# Altium schematic sheet KeyPadScanner.SchDoc
size B; PART_NAME: xc2s200epq208-5; Organization: Altium Limited; Address1: L3, 12a Rodborough Rd; Address2: Frenchs Forest; Address3: NSW; Address4: Australia 2086; DocumentNumber: 1; SheetNumber: 1; SheetTotal: 1
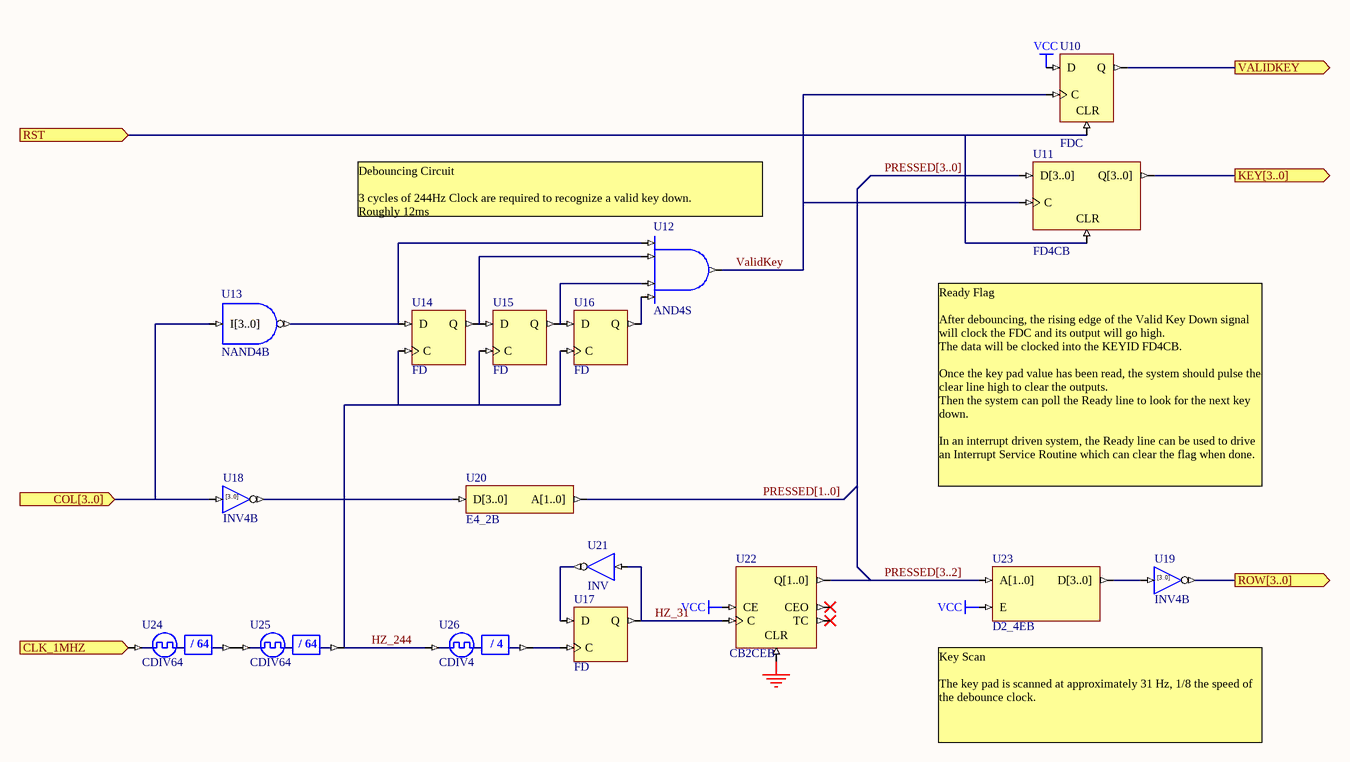
[diagram p0: KeyPadScanner.SchDoc]

## Parts
U10  FDC
U11  FD4CB
U12  AND4S
U13  NAND4B
U14  FD
U15  FD
U16  FD
U17  FD
U18  INV4B
U19  INV4B
U20  E4_2B
U21  INV
U22  CB2CEB
U23  D2_4EB
U24  CDIV64
U25  CDIV64
U26  CDIV4

## Ports
CLK_1MHZ (in), COL[3..0] (in), KEY[3..0] (out), ROW[3..0] (out), RST (in), VALIDKEY (out)

## Nets
GND: U22.CLR
VCC: U10.D U22.CE U23.E
CLK_1MHZ: U24.CLKIN ; port CLK_1MHZ
COL[3..0]: U13.I[3..0] U18.I[3..0] ; port COL[3..0]
HZ_31: U17.Q U21.I U22.C
HZ_244: U14.C U15.C U16.C U25.CLKDV U26.CLKIN
KEY[3..0]: U11.Q[3..0] ; port KEY[3..0]
PRESSED[1..0]: U20.A[1..0]
PRESSED[3..0]: U11.D[3..0]
PRESSED[3..2]: U22.Q[1..0] U23.A[1..0]
ROW[3..0]: U19.O[3..0] ; port ROW[3..0]
RST: U10.CLR U11.CLR ; port RST
ValidKey: U10.C U11.C U12.O
VALIDKEY: U10.Q ; port VALIDKEY  [a separate net that carries the same name]
NetU12_I0: U12.I0 U13.O U14.D
NetU12_I1: U12.I1 U14.Q U15.D
NetU12_I2: U12.I2 U15.Q U16.D
NetU12_I3: U12.I3 U16.Q
NetU17_C: U17.C U26.CLKDV
NetU17_D: U17.D U21.O
NetU18_O[3..0]: U18.O[3..0] U20.D[3..0]
NetU19_I[3..0]: U19.I[3..0] U23.D[3..0]
NetU24_CLKDV: U24.CLKDV U25.CLKIN

Not connected (* = marked no-connect by the designer): U22 CEO* TC*

## Buses and harness runs
bus PRESSED[1..0]
bus PRESSED[3..0]
bus PRESSED[3..2]

## Notes on the sheet
- (near U12) Debouncing Circuit
  3 cycles of 244Hz Clock are required to recognize a valid key down.
  Roughly 12ms
- Ready Flag
  After debouncing, the rising edge of the Valid Key Down signal will clock the FDC and its output will go high.
  The data will be clocked into the KEYID FD4CB.
  Once the key pad value has been read, the system should pulse the clear line high to clear the outputs.
  Then the system can poll the Ready line to look for the next key down.
  In an interrupt driven system, the Ready line can be used to drive an Interrupt Service Routine which can clear the flag when done.
- (near U23) Key Scan
  The key pad is scanned at approximately 31 Hz, 1/8 the speed of the debounce clock.
- Title
- Size:
- Date:
- B
- Number:
- Time:
- Revision:
- Sheet
- of
- File:
- (in symbol CDIV4) / 4
- (in symbol CDIV64) / 64
- (in symbol INV4B) [3..0]

## Library data of the parts
U10 = FDC: D-Type Flip-Flop with Asynchronous Clear; ArchiveName: GENERIC; Published: 18-Dec-2003; Publisher: Altium Limited; Xilinx Equivalent: FDC; Core Revision: 1.00.00
U11 = FD4CB: 4-Bit D-Type Flip-Flop with Asynchronous Clear, Bus Version; ArchiveName: GENERIC; Published: 18-Dec-2003; Publisher: Altium Limited; Core Revision: 1.00.00
U12 = AND4S: 4-Input AND Gate, Single Pin Version; Xilinx Equivalent: AND4; ArchiveName: GENERIC; Published: 7-Nov-2003; Publisher: Altium Limited; Core Revision: 1.00.00
U13 = NAND4B: 4-Input NAND Gate, Bus Version; ArchiveName: GENERIC; Published: 7-Nov-2003; Publisher: Altium Limited; Core Revision: 1.00.00
U14-U17 = FD: D-Type Flip-Flop; ArchiveName: GENERIC; Published: 9-30-2003; Publisher: Altium Limited; Xilinx Equivalent: FD; Core Revision: 1.00.00
U18 U19 = INV4B: 4-Bit Inverter, Bus Version; ArchiveName: GENERIC; Published: 18-Dec-2003; Publisher: Altium Limited; Core Revision: 1.00.00
U20 = E4_2B: 4- to 2-Bit Priority Encoder, Bus Version; ArchiveName: GENERIC; Published: 7-Nov-2003; Publisher: Altium Limited; Core Revision: 1.00.00
U21 = INV: Inverter; ArchiveName: GENERIC; Published: 9-30-2003; Publisher: Altium Limited; Xilinx Equivalent: INV; Core Revision: 1.00.00
U22 = CB2CEB: 2-Bit Cascadable Binary Counters with Clock Enable and Asynchronous Clear, Bus Version; ArchiveName: GENERIC; Published: 18-Dec-2003; Publisher: Altium Limited; Core Revision: 1.00.00
U23 = D2_4EB: Binary 2- to 4-Bit Decoder with Enable, Bus Version; ArchiveName: GENERIC; Published: 7-Nov-2003; Publisher: Altium Limited; Core Revision: 1.00.00
U24 U25 = CDIV64: Clock Divider by 64; ArchiveName: GENERIC; Published: 18-Dec-2003; Publisher: Altium Limited; Core Revision: 1.00.00
U26 = CDIV4: Clock Divider by 4; ArchiveName: GENERIC; Published: 18-Dec-2003; Publisher: Altium Limited; Core Revision: 1.00.00